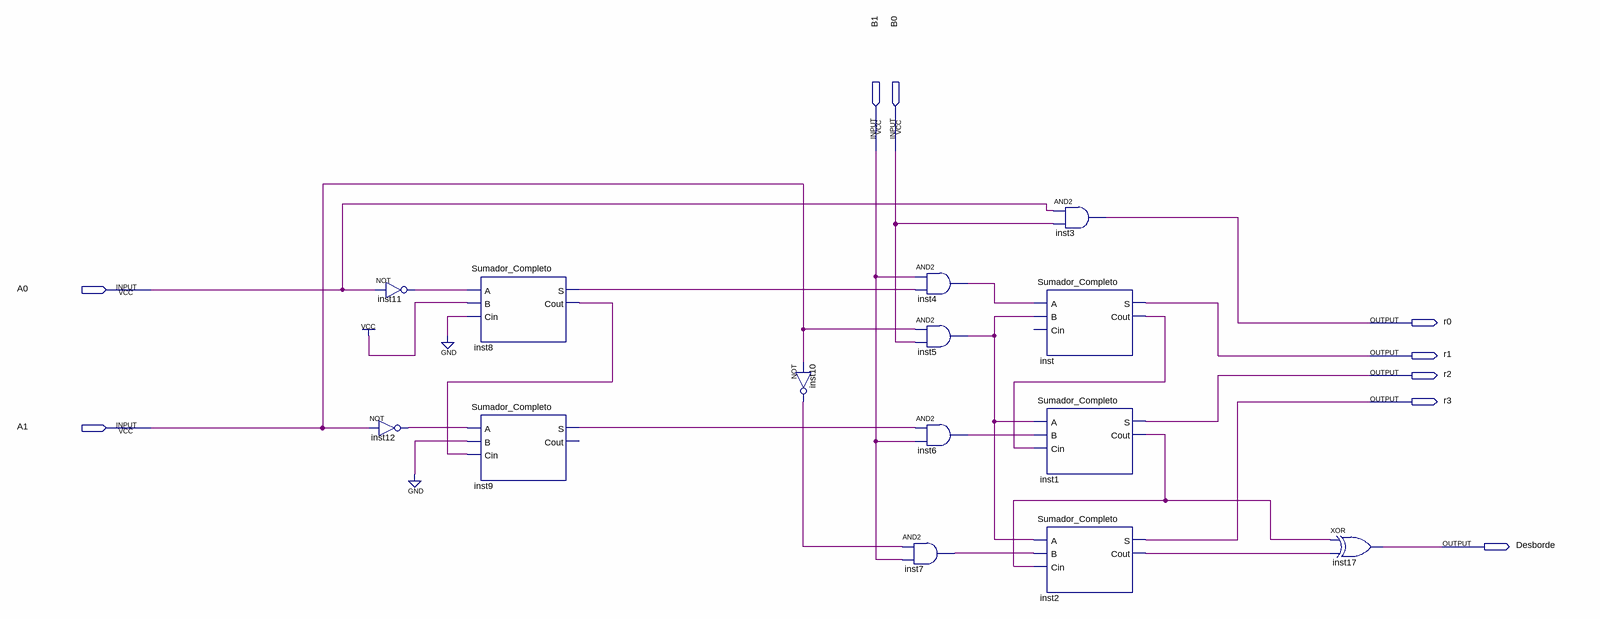
[diagram p0: schematic sheet]
// Quartus schematic multiplicador_signo_sinff.bdf as structural Verilog: 14 symbols, 9 pins
module multiplicador_signo_sinff (
  input  B1,
  input  B0,
  input  A0,
  input  A1,
  output r0,
  output r1,
  output r2,
  output r3,
  output Desborde
);

  wire inst1_cout, inst2_cout, inst4_out, inst5_out, inst6_out, inst7_out, inst8_cout, inst8_s, inst9_s,
       inst10_out, inst11_out, inst12_out, inst_cout;

  not inst11 (inst11_out, A0);
  not inst12 (inst12_out, A1);
  Sumador_Completo inst8 (.A(inst11_out), .B(1'b1), .Cin(1'b0), .S(inst8_s), .Cout(inst8_cout));
  Sumador_Completo inst9 (.A(inst12_out), .B(1'b0), .Cin(inst8_cout), .S(inst9_s));  // open: Cout
  not inst10 (inst10_out, A1);
  and inst7 (inst7_out, inst10_out, B1);
  and inst4 (inst4_out, B1, inst8_s);
  and inst5 (inst5_out, A1, B0);
  and inst6 (inst6_out, inst9_s, B1);
  and inst3 (r0, A0, B0);
  Sumador_Completo inst (.A(inst4_out), .B(inst5_out), .S(r1), .Cout(inst_cout));  // open: Cin
  Sumador_Completo inst1 (.A(inst5_out), .B(inst6_out), .Cin(inst_cout), .S(r2), .Cout(inst1_cout));
  Sumador_Completo inst2 (.A(inst5_out), .B(inst7_out), .Cin(inst1_cout), .S(r3), .Cout(inst2_cout));
  xor inst17 (Desborde, inst1_cout, inst2_cout);
endmodule
